# EAGLE schematic 211_MLL-Range-Extender-CAT5_V103 (EAGLE 9.6.2)

## Sheet 1 of 2
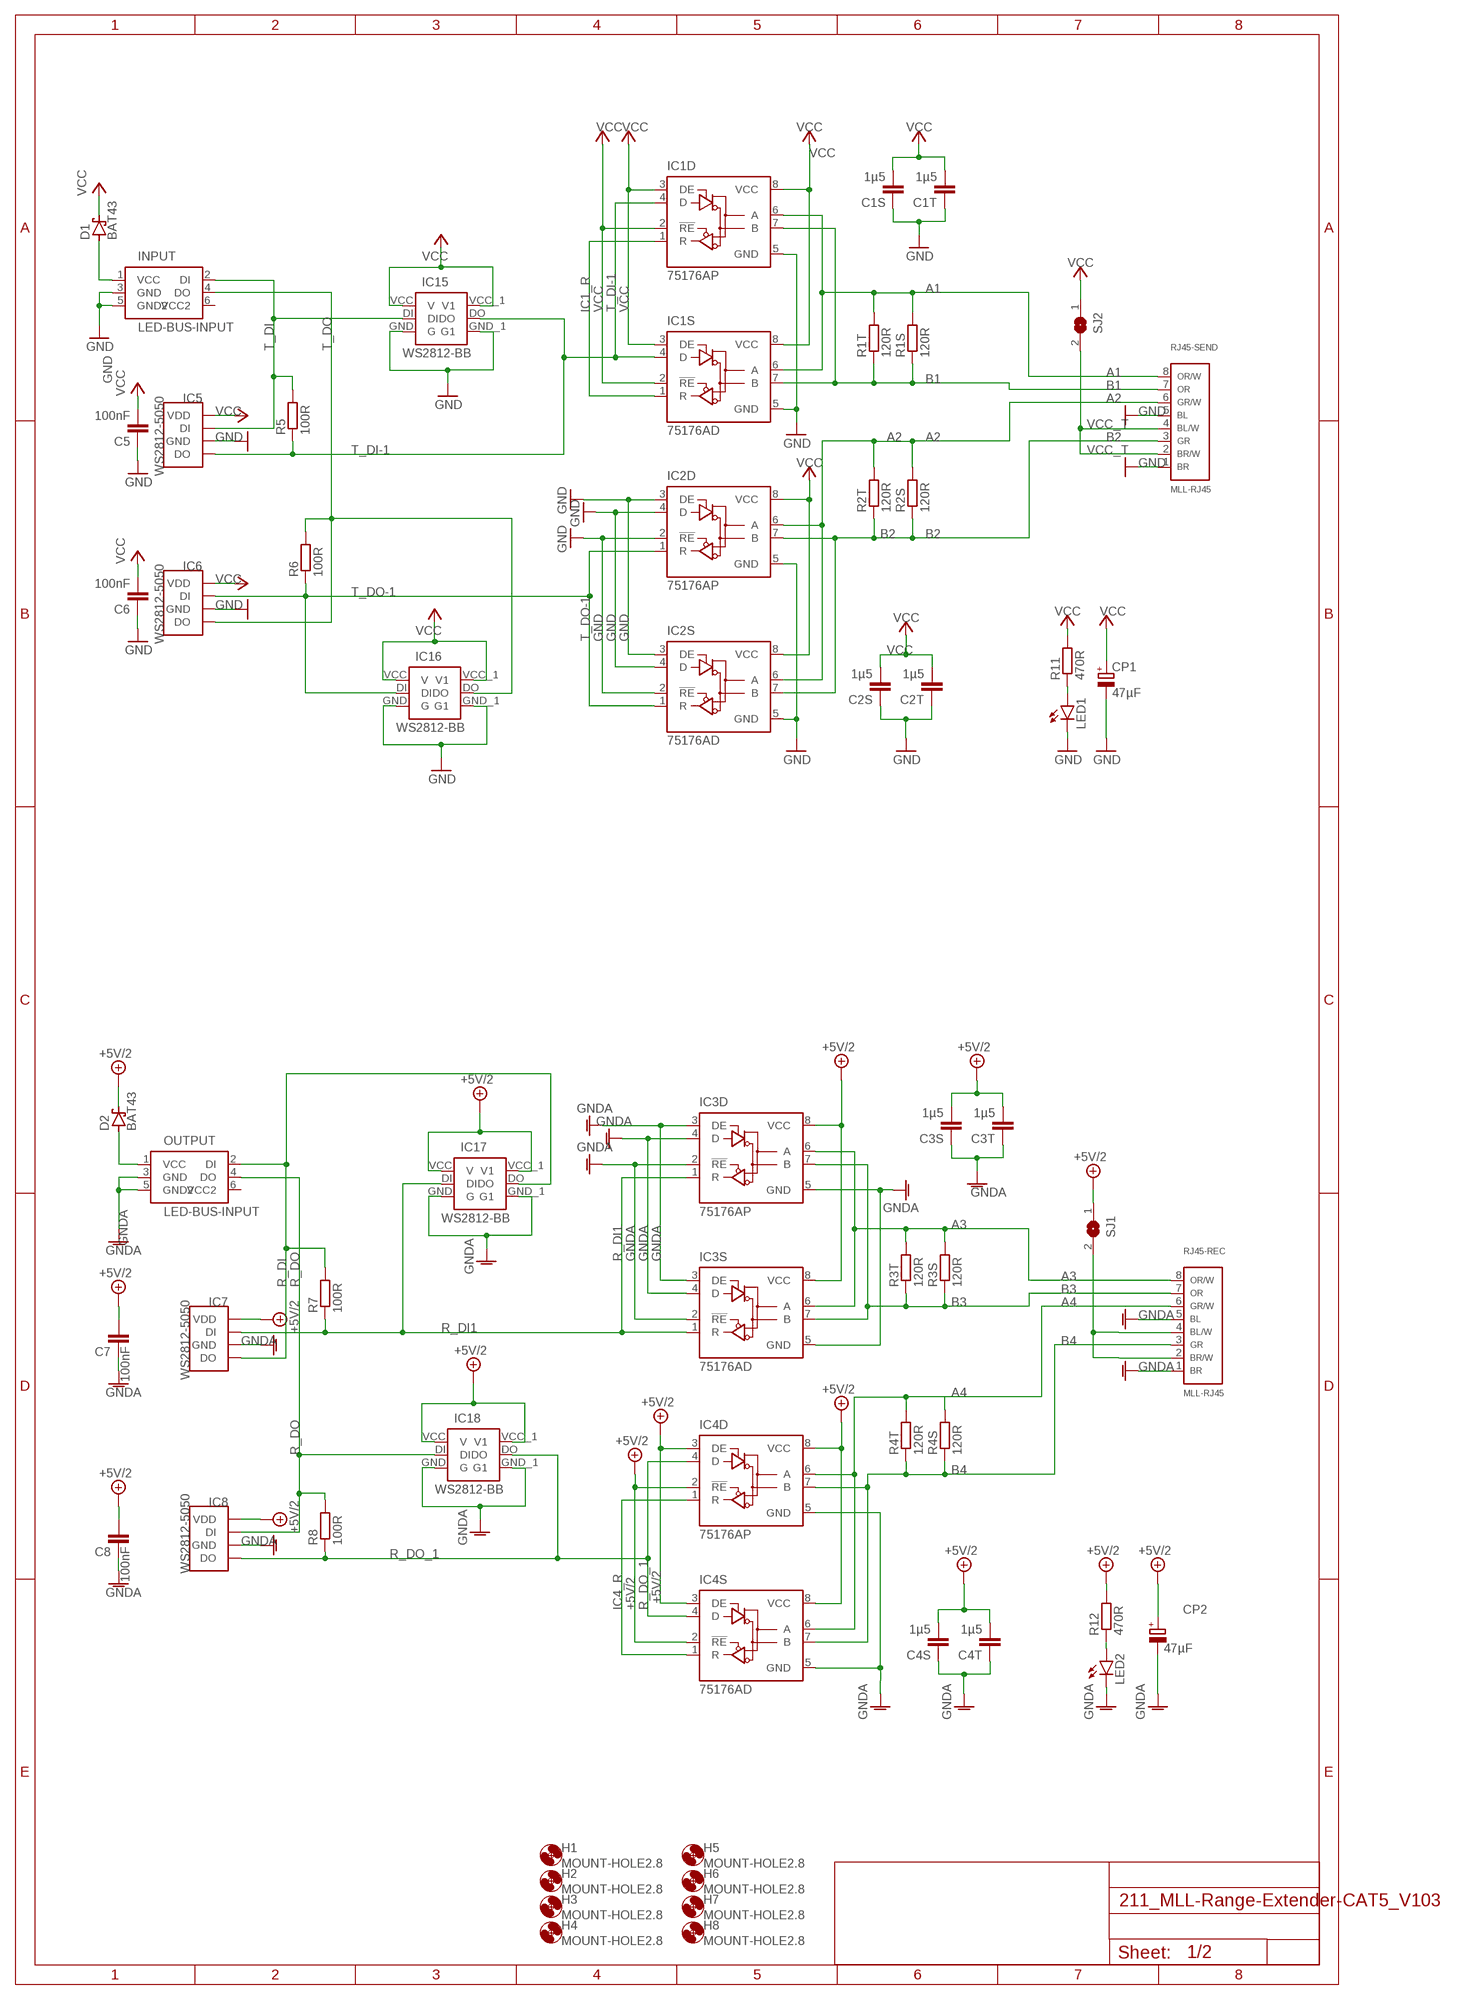
[diagram p0: schematic, sheet 1]

### Parts
C1S  1µ5  C-EUC1210  [C1210]
C1T  1µ5  C-EU050-025X075  [C050-025X075]
C2S  1µ5  C-EUC1210  [C1210]
C2T  1µ5  C-EU050-025X075  [C050-025X075]
C3S  1µ5  C-EUC1210  [C1210]
C3T  1µ5  C-EU050-025X075  [C050-025X075]
C4S  1µ5  C-EUC1210  [C1210]
C4T  1µ5  C-EU050-025X075  [C050-025X075]
C5  100nF  C-EU025-025X050  [C025-025X050]
C6  100nF  C-EU025-025X050  [C025-025X050]
C7  100nF  C-EU025-025X050  [C025-025X050]
C8  100nF  C-EU025-025X050  [C025-025X050]
CP1  47µF  CPOL-EUE2-5  [E2-5]
CP2  47µF  CPOL-EUE2-5  [E2-5]
D1  BAT43  BAT42  [DO35-10]
D2  BAT43  BAT42  [DO35-10]
H1  MOUNT-HOLE2.8  [2,8]
H2  MOUNT-HOLE2.8  [2,8]
H3  MOUNT-HOLE2.8  [2,8]
H4  MOUNT-HOLE2.8  [2,8]
H5  MOUNT-HOLE2.8  [2,8]
H6  MOUNT-HOLE2.8  [2,8]
H7  MOUNT-HOLE2.8  [2,8]
H8  MOUNT-HOLE2.8  [2,8]
IC1D  75176AP  [DIL08]
IC1S  75176AD  [D_R-PDSO-G8]
IC2D  75176AP  [DIL08]
IC2S  75176AD  [D_R-PDSO-G8]
IC3D  75176AP  [DIL08]
IC3S  75176AD  [D_R-PDSO-G8]
IC4D  75176AP  [DIL08]
IC4S  75176AD  [D_R-PDSO-G8]
IC5  WS2812-5050  [5050]
IC6  WS2812-5050  [5050]
IC7  WS2812-5050  [5050]
IC8  WS2812-5050  [5050]
IC15  WS2812-BB  [WS2812B-PCB2]
IC16  WS2812-BB  [WS2812B-PCB2]
IC17  WS2812-BB  [WS2812B-PCB2]
IC18  WS2812-BB  [WS2812B-PCB2]
INPUT  LED-BUS-INPUT  [IDC6]
LED1  LED3MM  [LED3MM]
LED2  LED3MM  [LED3MM]
OUTPUT  LED-BUS-INPUT  [IDC6]
R1S  120R  R-EU_R1210  [R1210]
R1T  120R  R-EU_0207/10  [0207/10]
R2S  120R  R-EU_R1210  [R1210]
R2T  120R  R-EU_0207/10  [0207/10]
R3S  120R  R-EU_R1210  [R1210]
R3T  120R  R-EU_0207/10  [0207/10]
R4S  120R  R-EU_R1210  [R1210]
R4T  120R  R-EU_0207/10  [0207/10]
R5  100R  R-EU_0207/10  [0207/10]
R6  100R  R-EU_0207/10  [0207/10]
R7  100R  R-EU_0207/10  [0207/10]
R8  100R  R-EU_0207/10  [0207/10]
R11  470R  R-EU_0207/10  [0207/10]
R12  470R  R-EU_0207/10  [0207/10]
RJ45-REC  MLL-RJ45  [RJ45_U]
RJ45-SEND  MLL-RJ45  [RJ45_U]
SJ1  SJ  [SJ]
SJ2  SJ  [SJ]

### Nets
+5V/2: C3S.2 C3T.2 C4S.2 C4T.2 C7.2 C8.2 CP2.+ D2.C IC3D.8(VCC) IC3S.8(VCC) IC4D.2(!RE) IC4D.3(DE) IC4D.8(VCC) IC4S.2(!RE) IC4S.3(DE) IC4S.8(VCC) IC7.VCC(VDD) IC8.VCC(VDD) IC17.VCC(V) IC17.VCC_1(V1) IC18.VCC(V) IC18.VCC_1(V1) R12.2 SJ1.1
A1: IC1D.6(A) IC1S.6(A) R1S.2 R1T.2 RJ45-SEND.8(ORANGE/WHITE)
A2: IC2D.6(A) IC2S.6(A) R2S.2 R2T.2 RJ45-SEND.6(GREEN/WHITE)
A3: IC3D.6(A) IC3S.6(A) R3S.2 R3T.2 RJ45-REC.8(ORANGE/WHITE)
A4: IC4D.6(A) IC4S.6(A) R4S.2 R4T.2 RJ45-REC.6(GREEN/WHITE)
B1: IC1D.7(B) IC1S.7(B) R1S.1 R1T.1 RJ45-SEND.7(OPRANGE)
B2: IC2D.7(B) IC2S.7(B) R2S.1 R2T.1 RJ45-SEND.3(GREEN)
B3: IC3D.7(B) IC3S.7(B) R3S.1 R3T.1 RJ45-REC.7(OPRANGE)
B4: IC4D.7(B) IC4S.7(B) R4S.1 R4T.1 RJ45-REC.3(GREEN)
GND: C1S.1 C1T.1 C2S.1 C2T.1 C5.1 C6.1 CP1.- IC1D.5(GND) IC1S.5(GND) IC2D.2(!RE) IC2D.3(DE) IC2D.4(D) IC2D.5(GND) IC2S.2(!RE) IC2S.3(DE) IC2S.4(D) IC2S.5(GND) IC5.GND IC6.GND IC15.GND(G) IC15.GND_1(G1) IC16.GND(G) IC16.GND_1(G1) INPUT.3(GND) INPUT.5(GND2) LED1.K(C) RJ45-SEND.1(BROWN) RJ45-SEND.5(BLUE)
GNDA: C3S.1 C3T.1 C4S.1 C4T.1 C7.1 C8.1 CP2.- IC3D.2(!RE) IC3D.3(DE) IC3D.4(D) IC3D.5(GND) IC3S.2(!RE) IC3S.3(DE) IC3S.4(D) IC3S.5(GND) IC4D.5(GND) IC4S.5(GND) IC7.GND IC8.GND IC17.GND(G) IC17.GND_1(G1) IC18.GND(G) IC18.GND_1(G1) LED2.K(C) OUTPUT.3(GND) OUTPUT.5(GND2) RJ45-REC.1(BROWN) RJ45-REC.5(BLUE)
IC1_R: IC1D.1(R) IC1S.1(R)
IC4_R: IC4D.1(R) IC4S.1(R)
LED1-R: LED1.A R11.1
LED2_R: LED2.A R12.1
N$1: D1.A INPUT.1(VCC)
R_DI: IC7.DO IC17.DO OUTPUT.2(DI) R7.2
R_DI1: IC3D.1(R) IC3S.1(R) IC7.DI IC17.DI R7.1
R_DO: IC8.DI IC18.DI OUTPUT.4(DO) R8.2
R_DO_1: IC4D.4(D) IC4S.4(D) IC8.DO IC18.DO R8.1
T_DI: IC5.DI IC15.DI INPUT.2(DI) R5.2
T_DI-1: IC1D.4(D) IC1S.4(D) IC5.DO IC15.DO R5.1
T_DO: IC6.DO IC16.DO INPUT.4(DO) R6.2
T_DO-1: IC2D.1(R) IC2S.1(R) IC6.DI IC16.DI R6.1
VCC: C1S.2 C1T.2 C2S.2 C2T.2 C5.2 C6.2 CP1.+ D1.C IC1D.2(!RE) IC1D.3(DE) IC1D.8(VCC) IC1S.2(!RE) IC1S.3(DE) IC1S.8(VCC) IC2D.8(VCC) IC2S.8(VCC) IC5.VCC(VDD) IC6.VCC(VDD) IC15.VCC(V) IC15.VCC_1(V1) IC16.VCC(V) IC16.VCC_1(V1) R11.2 SJ2.1
VCC_T: RJ45-SEND.2(BROWN/WHITE) RJ45-SEND.4(BLUE/WHITE) SJ2.2
VDD_IN: D2.A OUTPUT.1(VCC)
VDD_T: RJ45-REC.2(BROWN/WHITE) RJ45-REC.4(BLUE/WHITE) SJ1.2

## Sheet 2 of 2
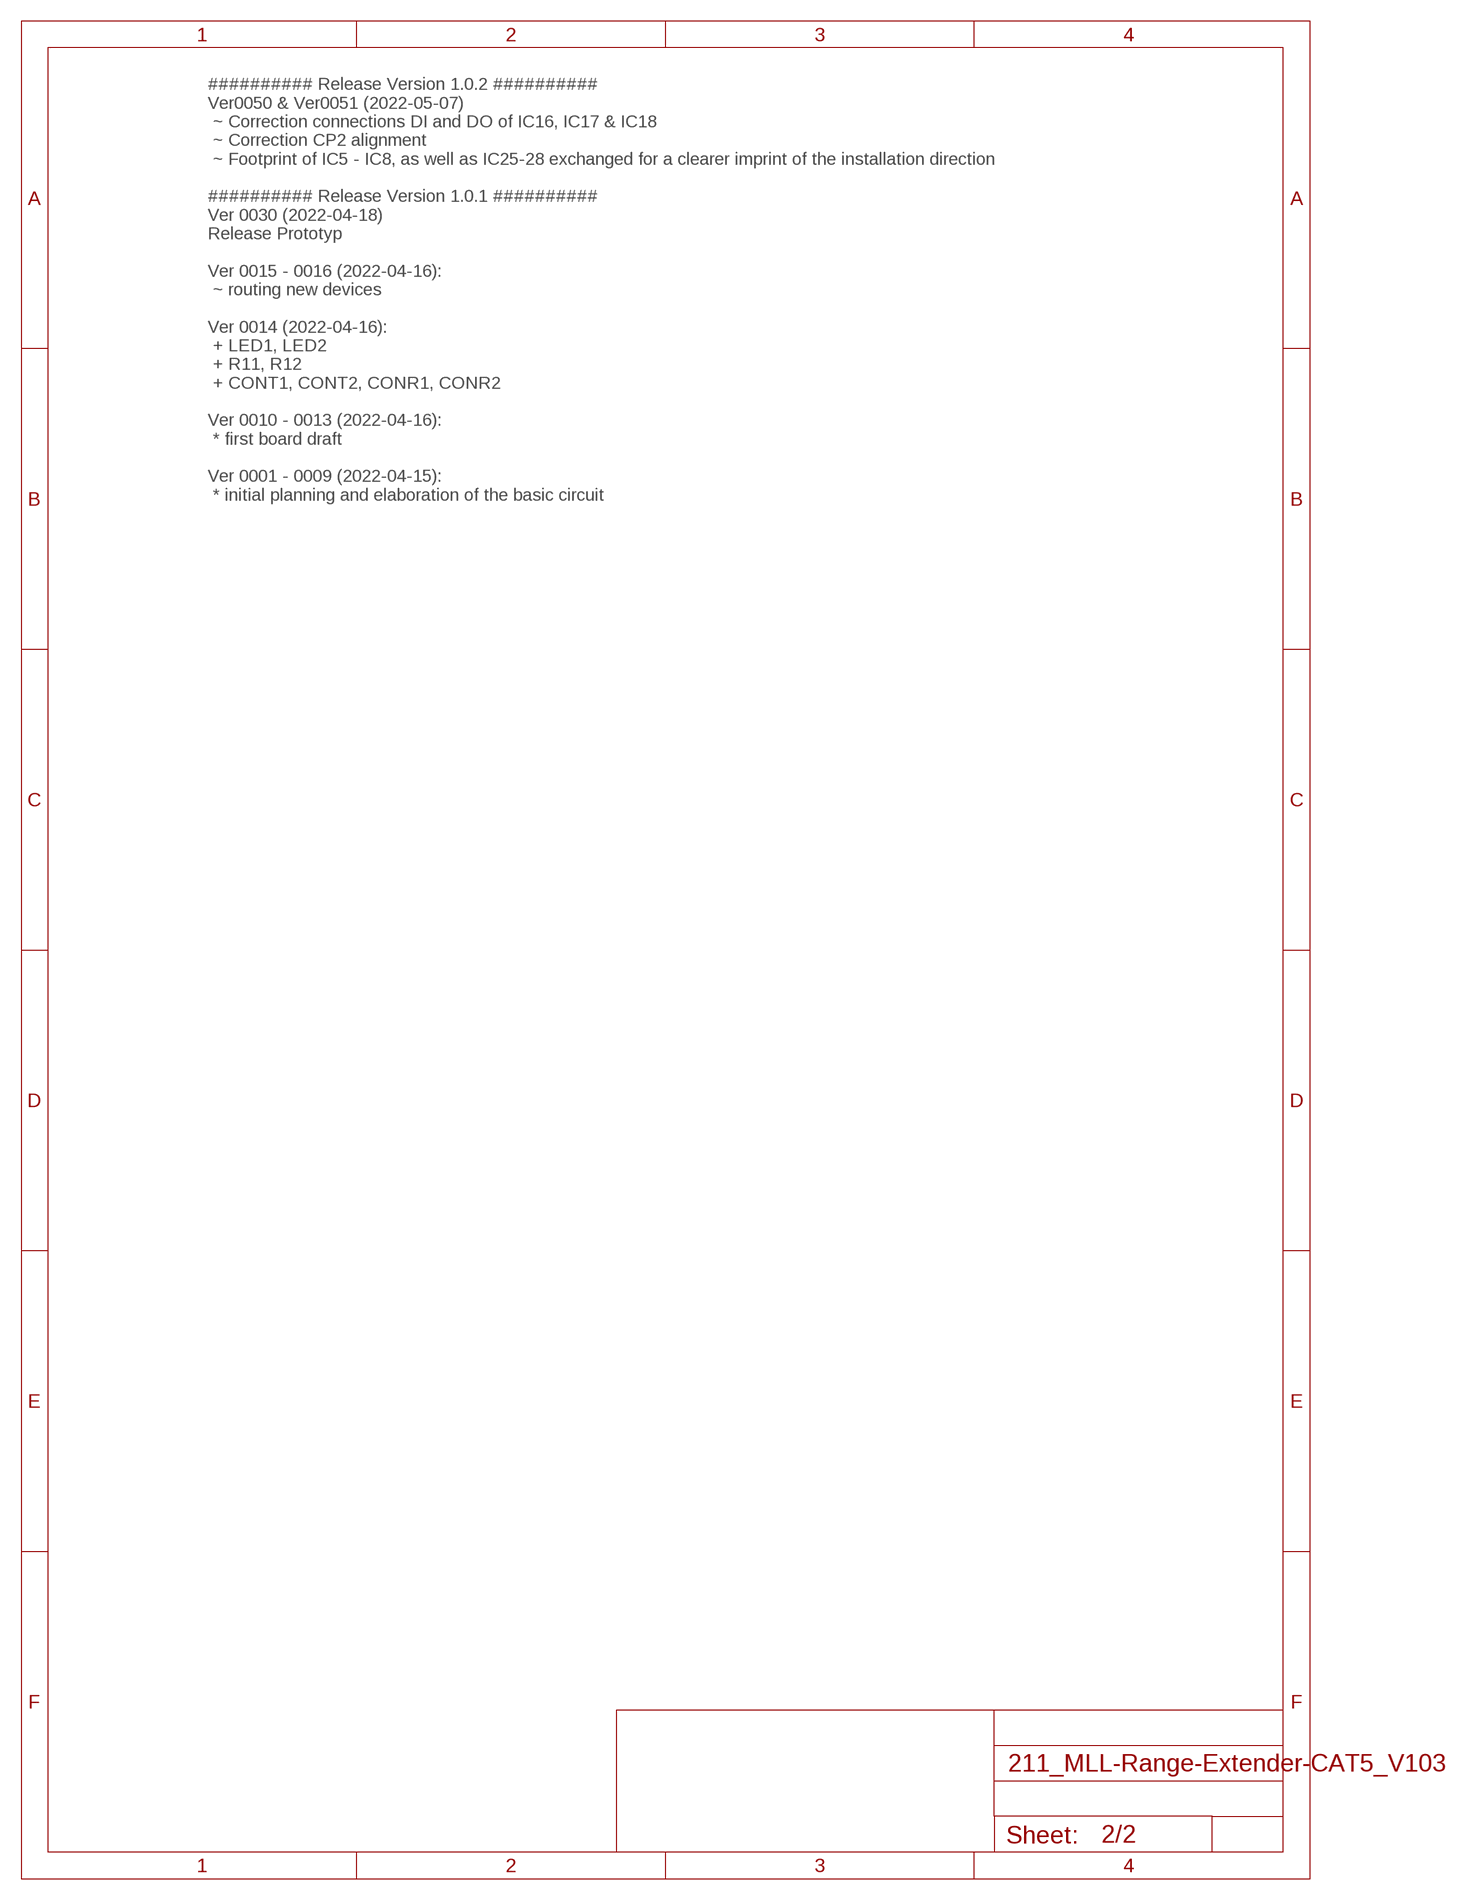
[diagram p1: schematic, sheet 2]

### Notes on the sheet
- ########## Release Version 1.0.2 ##########
  Ver0050 & Ver0051 (2022-05-07)
   ~ Correction connections DI and DO of IC16, IC17 & IC18
   ~ Correction CP2 alignment
   ~ Footprint of IC5 - IC8, as well as IC25-28 exchanged for a clearer imprint of the installation direction
  
  ########## Release Version 1.0.1 ##########
  Ver 0030 (2022-04-18)
  Release Prototyp
  
  Ver 0015 - 0016 (2022-04-16):
   ~ routing new devices
  
  Ver 0014 (2022-04-16):
   + LED1, LED2
   + R11, R12
   + CONT1, CONT2, CONR1, CONR2
  
  Ver 0010 - 0013 (2022-04-16):
   * first board draft
  
  Ver 0001 - 0009 (2022-04-15):
   * initial planning and elaboration of the basic circuit

## Power pins joined to a net without a drawn wire
VCC2: INPUT.6(VCC2) OUTPUT.6(VCC2)

## Library data of the parts
C1S C1T C2S C2T C3S C3T C4S C4T C5-C8 = rcl:C-EU: CAPACITOR, European symbol; SPICEPREFIX: C
CP1 CP2 = rcl:CPOL-EU: POLARIZED CAPACITOR, European symbol; SPICEPREFIX: C
D1 D2 = diode:BAT42: DIODE barrier diode
H1-H8 = holes:MOUNT-HOLE: MOUNTING HOLE with drill center marker
IC1D IC1S IC2D IC2S IC3D IC3S IC4D IC4S = 751xx:75176A: DIFFERENTIAL BUS TRANSCEIVER Source: http://focus.ti.com/lit/ds/symlink/sn75176a.pdf
IC5-IC8 = HD_ICs:WS2812-
IC15-IC18 = HD_ICs:WS2812-BB
INPUT OUTPUT = HD_Kontakte:LED-BUS-INPUT
LED1 LED2 = led:LED: LED OSRAM: - CHIPLED LG R971, LG N971, LY N971, LG Q971, LY Q971, LO R971, LY R971 LH N974, LH R974 LS Q976, LO Q976, LY Q976 LO Q996 - Hyper CHIPLED LW Q18S LB Q993, LB Q99A, LB R99A - SideLED LS A670, LO A670, LY A670, LG A670, LP A670 LB A673, LV A673, LT A673, LW A673 LH A674 LY A675 LS A676, LA A676, LO A676, LY A676, LW A676 LS A679, LY A679, LG A679 - Hyper Micro SIDELED® LS Y876, LA Y876, LO Y876, LY Y876 LT Y87S - SmartLED LW L88C, LW L88S LB L89C, LB L89S, LG L890 LS L89K, LO L89K, LY L89K LS L896, LA L896, LO L896, LY L896 - TOPLED LS T670, LO T670, LY T670, LG T670, LP T670 LSG T670, LSP T670, LSY T670, LOP T670, LYG T670 LG T671, LOG T671, LSG T671 LB T673, LV T673, LT T673, LW T673 LH T674 LS T676, LA T676, LO T676, LY T676, LB T676, LH T676, LSB T676, LW T676 LB T67C, LV T67C, LT T67C, LS T67K, LO T67K, LY T67K, LW E67C LS E67B, LA E67B, LO E67B, LY E67B, LB E67C, LV E67C, LT E67C LW T67C LS T679, LY T679, LG T679 LS T770, LO T770, LY T770, LG T770, LP T770 LB T773, LV T773, LT T773, LW T773 LH T774 LS E675, LA E675, LY E675, LS T675 LS T776, LA T776, LO T776, LY T776, LB T776 LHGB T686 LT T68C, LB T68C - Hyper Mini TOPLED® LB M676 - Mini TOPLED Santana® LG M470 LS M47K, LO M47K, LY M47K Source: http://www.osram.convergy.de LUXEON: - LUMILED® LXK2-PW12-R00, LXK2-PW12-S00, LXK2-PW14-U00, LXK2-PW14-V00 LXK2-PM12-R00, LXK2-PM12-S00, LXK2-PM14-U00 LXK2-PE12-Q00, LXK2-PE12-R00, LXK2-PE12-S00, LXK2-PE14-T00, LXK2-PE14-U00 LXK2-PB12-K00, LXK2-PB12-L00, LXK2-PB12-M00, LXK2-PB14-N00, LXK2-PB14-P00, LXK2-PB14-Q00 LXK2-PR12-L00, LXK2-PR12-M00, LXK2-PR14-Q00, LXK2-PR14-R00 LXK2-PD12-Q00, LXK2-PD12-R00, LXK2-PD12-S00 LXK2-PH12-R00, LXK2-PH12-S00 LXK2-PL12-P00, LXK2-PL12-Q00, LXK2-PL12-R00 Source: www.luxeon.com KINGBRIGHT: KA-3528ASYC Source: www.kingbright.com
R1S R1T R2S R2T R3S R3T R4S R4T R5-R8 R11 R12 = rcl:R-EU_: RESISTOR, European symbol; SPICEPREFIX: R
RJ45-REC RJ45-SEND = HD_Kontakte:MLL-RJ45
SJ1 SJ2 = jumper:SJ: SMD solder JUMPER